# EAGLE design GoldFishFront-R2 (EAGLE 6.5.0)
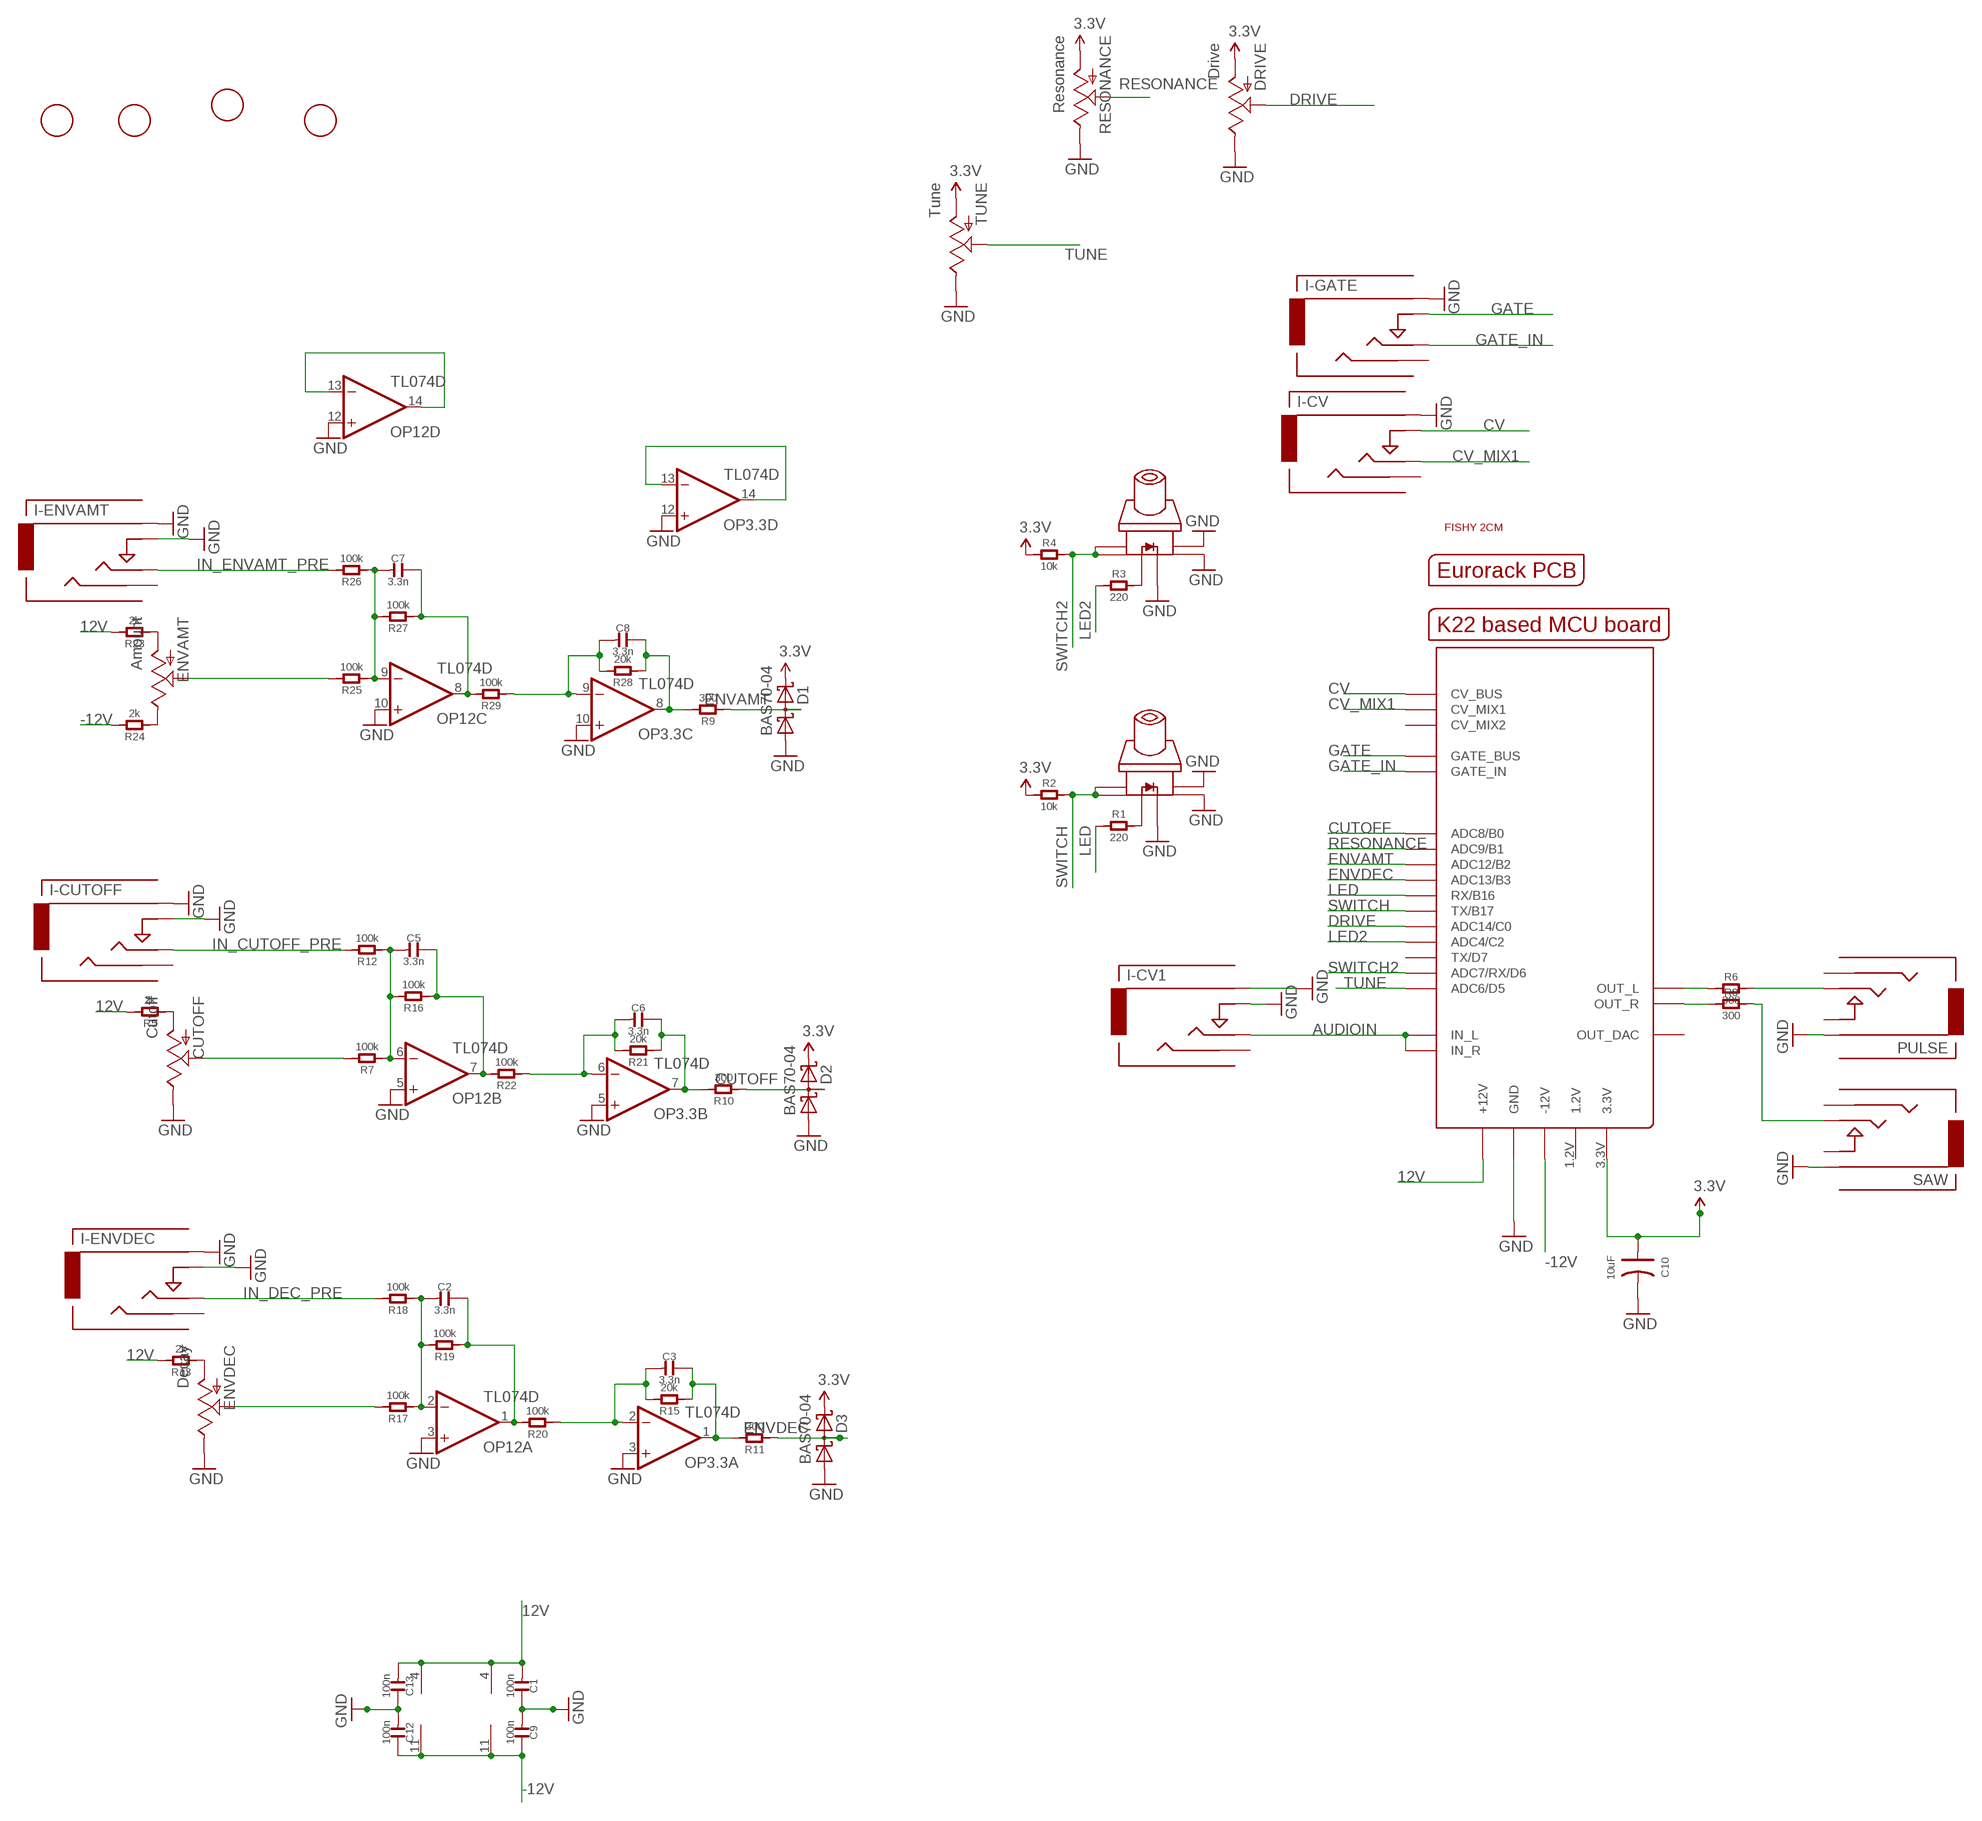
[diagram p0: schematic, sheet 1]

## Parts
C1  100n  C-0603  [C0603]
C2  3.3n  C-0603  [C0603]
C3  3.3n  C-0603  [C0603]
C5  3.3n  C-0603  [C0603]
C6  3.3n  C-0603  [C0603]
C7  3.3n  C-0603  [C0603]
C8  3.3n  C-0603  [C0603]
C9  100n  C-0603  [C0603]
C10  10uF  C-POLAR-A  [AVX-A]
C12  100n  C-0603  [C0603]
C13  100n  C-0603  [C0603]
CUTOFF  Cutoff  POTZEPHPOT  [OG-POTS_ALPS_POT_VERTICAL]
D1  BAS70-04  [SOT23]
D2  BAS70-04  [SOT23]
D3  BAS70-04  [SOT23]
DRIVE  Drive  POTZEPHPOT  [OG-POTS_ALPS_POT_VERTICAL]
ENVAMT  Amount  POTZEPHPOT  [OG-POTS_ALPS_POT_VERTICAL]
ENVDEC  Decay  POTZEPHPOT  [OG-POTS_ALPS_POT_VERTICAL]
I-CUTOFF  Cutoff  AUDIO-JACKINPUT  [3.5MM-JACK-SWITCH-13MM-INPUT]
I-CV  CV  AUDIO-JACKINPUT  [3.5MM-JACK-SWITCH-13MM-INPUT]
I-CV1  External  AUDIO-JACKINPUT  [3.5MM-JACK-SWITCH-13MM-INPUT]
I-ENVAMT  Amount  AUDIO-JACKINPUT  [3.5MM-JACK-SWITCH-13MM-INPUT]
I-ENVDEC  Decay  AUDIO-JACKINPUT  [3.5MM-JACK-SWITCH-13MM-INPUT]
I-GATE  Gate  AUDIO-JACKINPUT  [3.5MM-JACK-SWITCH-13MM-INPUT]
OP3.3  TL074D  [SO14]
OP12  TL074D  [SO14]
PULSE  Pulse  AUDIO-JACKOUTPUT  [3.5MM-JACK-SWITCH-13MM-OUTPUT]
R1  220  R-0603  [R0603]
R2  10k  R-0603  [R0603]
R3  220  R-0603  [R0603]
R4  10k  R-0603  [R0603]
R5  2k  R-0603  [R0603]
R6  300  R  [C0805]
R7  100k  R-0603  [R0603]
R8  300  R  [C0805]
R9  300  R-0603  [R0603]
R10  300  R-0603  [R0603]
R11  300  R-0603  [R0603]
R12  100k  R-0603  [R0603]
R13  2k  R-0603  [R0603]
R15  20k  R-0603  [R0603]
R16  100k  R-0603  [R0603]
R17  100k  R-0603  [R0603]
R18  100k  R-0603  [R0603]
R19  100k  R-0603  [R0603]
R20  100k  R-0603  [R0603]
R21  20k  R-0603  [R0603]
R22  100k  R-0603  [R0603]
R23  2k  R-0603  [R0603]
R24  2k  R-0603  [R0603]
R25  100k  R-0603  [R0603]
R26  100k  R-0603  [R0603]
R27  100k  R-0603  [R0603]
R28  20k  R-0603  [R0603]
R29  100k  R-0603  [R0603]
RESONANCE  Resonance  POTZEPHPOT  [OG-POTS_ALPS_POT_VERTICAL]
SAW  Saw  AUDIO-JACKOUTPUT  [3.5MM-JACK-SWITCH-13MM-OUTPUT]
TUNE  Tune  POTZEPHPOT  [OG-POTS_ALPS_POT_VERTICAL]
U$1  MCUBOARD  [MCUBASEBOARD]
U$2  EURORACK_PCB12HP  [EURORACK12HPPCB]
U$3  FISH2CM_SILK  [FISH_WITHSILK]
U$4  FIDUCIAL  [FIDUCIAL_1MM]
U$5  FIDUCIAL  [FIDUCIAL_1MM]
U$6  SWITCH_W_LED_PB6149L-X-102WHITE  [PB6149L]
U$7  FIDUCIAL  [FIDUCIAL_1MM]
U$8  FIDUCIAL  [FIDUCIAL_1MM]
U$17  SWITCH_W_LED_PB6149L-X-102WHITE  [PB6149L]

## Nets
3.3V: C10.+ D1.2(C2) D2.2(C2) D3.2(C2) DRIVE.P$3(A) R2.1 R4.1 RESONANCE.P$3(A) TUNE.P$3(A) U$1.3.3V
12V: C1.1 C13.1 OP3.3.4(P:V+) OP12.4(P:V+) R5.2 R13.2 R23.2 U$1.+12V@1(+12V) U$1.+12V@2(+12V)
-12V: C9.2 C12.2 OP3.3.11(P:V-) OP12.11(P:V-) R24.2 U$1.-12V@1(-12V) U$1.-12V@2(-12V)
AUDIOIN: I-CV1.TIP@1(TIP) I-CV1.TIP@2(TIP) U$1.IN_L U$1.IN_R
CUTOFF: D2.3(C1A2) R10.1 U$1.ADC8(ADC8/B0)
CV: I-CV.SWITCH@1(SWITCH) I-CV.SWITCH@2(SWITCH) U$1.CVBUS(CV_BUS)
CV_MIX1: I-CV.TIP@1(TIP) I-CV.TIP@2(TIP) U$1.CV_MIX1
DRIVE: DRIVE.P$2(S) U$1.ADC14(ADC14/C0)
ENVAMT: D1.3(C1A2) R9.1 U$1.ADC12(ADC12/B2)
ENVAMTPREPROTECTION: C8.2 OP3.3.8(C:OUT) R9.2 R28.1
ENVDEC: D3.3(C1A2) R11.1 U$1.ADC13(ADC13/B3)
ENVDECPREPROTECTION: C3.2 OP3.3.1(A:OUT) R11.2 R15.1
GATE: I-GATE.SWITCH@1(SWITCH) I-GATE.SWITCH@2(SWITCH) U$1.GATE_BUS
GATE_IN: I-GATE.TIP@1(TIP) I-GATE.TIP@2(TIP) U$1.GATE_IN
GND: C1.2 C9.1 C10.- C12.1 C13.2 CUTOFF.P$1(E) D1.1(A1) D2.1(A1) D3.1(A1) DRIVE.P$1(E) ENVDEC.P$1(E) I-CUTOFF.RING@1(RING) I-CUTOFF.RING@2(RING) I-CUTOFF.SWITCH@1(SWITCH) I-CUTOFF.SWITCH@2(SWITCH) I-CV1.RING@1(RING) I-CV1.RING@2(RING) I-CV1.SWITCH@1(SWITCH) I-CV1.SWITCH@2(SWITCH) I-CV.RING@1(RING) I-CV.RING@2(RING) I-ENVAMT.RING@1(RING) I-ENVAMT.RING@2(RING) I-ENVAMT.SWITCH@1(SWITCH) I-ENVAMT.SWITCH@2(SWITCH) I-ENVDEC.RING@1(RING) I-ENVDEC.RING@2(RING) I-ENVDEC.SWITCH@1(SWITCH) I-ENVDEC.SWITCH@2(SWITCH) I-GATE.RING@1(RING) I-GATE.RING@2(RING) OP3.3.3(A:+IN) OP3.3.5(B:+IN) OP3.3.10(C:+IN) OP3.3.12(D:+IN) OP12.3(A:+IN) OP12.5(B:+IN) OP12.10(C:+IN) OP12.12(D:+IN) PULSE.RING@1(RING) PULSE.RING@2(RING) RESONANCE.P$1(E) SAW.RING@1(RING) SAW.RING@2(RING) TUNE.P$1(E) U$1.GND@1(GND) U$1.GND@2(GND) U$1.GND@4(GND) U$1.GND@5(GND) U$1.GND@6(GND) U$1.GND@7(GND) U$1.GND@8(GND) U$1.GND@9(GND) U$1.GND_BUS(GND) U$6.3 U$6.4 U$6.LEDNEG(NEG) U$17.3 U$17.4 U$17.LEDNEG(NEG)
IN_CUTOFF_PRE: I-CUTOFF.TIP@1(TIP) I-CUTOFF.TIP@2(TIP) R12.2
IN_DEC_PRE: I-ENVDEC.TIP@1(TIP) I-ENVDEC.TIP@2(TIP) R18.2
IN_ENVAMT_PRE: I-ENVAMT.TIP@1(TIP) I-ENVAMT.TIP@2(TIP) R26.2
LED: R1.1 U$1.RX/B16
LED2: R3.1 U$1.ADC4(ADC4/C2)
N$1: PULSE.TIP@1(TIP) PULSE.TIP@2(TIP) R6.2
N$2: R8.2 SAW.TIP@1(TIP) SAW.TIP@2(TIP)
N$3: R6.1 U$1.OUT_L
N$4: R3.2 U$6.LEDPOS(POS)
N$5: CUTOFF.P$3(A) R5.1
N$6: R8.1 U$1.OUT_R
N$7: OP12.13(D:-IN) OP12.14(D:OUT)
N$8: OP3.3.13(D:-IN) OP3.3.14(D:OUT)
N$9: ENVDEC.P$3(A) R13.1
N$10: R1.2 U$17.LEDPOS(POS)
N$12: ENVDEC.P$2(S) R17.2
N$13: C2.1 OP12.2(A:-IN) R17.1 R18.1 R19.2
N$14: C2.2 OP12.1(A:OUT) R19.1 R20.2
N$15: C3.1 OP3.3.2(A:-IN) R15.2 R20.1
N$17: CUTOFF.P$2(S) R7.2
N$18: C5.1 OP12.6(B:-IN) R7.1 R12.1 R16.2
N$19: C5.2 OP12.7(B:OUT) R16.1 R22.2
N$20: C6.1 OP3.3.6(B:-IN) R21.2 R22.1
N$22: ENVAMT.P$3(A) R23.1
N$23: ENVAMT.P$1(E) R24.1
N$24: ENVAMT.P$2(S) R25.2
N$25: C7.1 OP12.9(C:-IN) R25.1 R26.1 R27.2
N$26: C7.2 OP12.8(C:OUT) R27.1 R29.2
N$27: C8.1 OP3.3.9(C:-IN) R28.2 R29.1
PREPROTECTCUTOFF: C6.2 OP3.3.7(B:OUT) R10.2 R21.1
RESONANCE: RESONANCE.P$2(S) U$1.ADC9(ADC9/B1)
SWITCH: R2.2 U$1.TX/B17 U$17.1 U$17.2
SWITCH2: R4.2 U$1.ADC7(ADC7/RX/D6) U$6.1 U$6.2
TUNE: TUNE.P$2(S) U$1.ADC6(ADC6/D5)
Unconnected: I-CUTOFF.SECOND@1(SECOND) I-CUTOFF.SECOND@2(SECOND) I-CV1.SECOND@1(SECOND) I-CV1.SECOND@2(SECOND) I-CV.SECOND@1(SECOND) I-CV.SECOND@2(SECOND) I-ENVAMT.SECOND@1(SECOND) I-ENVAMT.SECOND@2(SECOND) I-ENVDEC.SECOND@1(SECOND) I-ENVDEC.SECOND@2(SECOND) I-GATE.SECOND@1(SECOND) I-GATE.SECOND@2(SECOND) PULSE.SECOND@1(SECOND) PULSE.SECOND@2(SECOND) PULSE.SWITCH@1(SWITCH) PULSE.SWITCH@2(SWITCH) SAW.SECOND@1(SECOND) SAW.SECOND@2(SECOND) SAW.SWITCH@1(SWITCH) SAW.SWITCH@2(SWITCH) U$1.1.2V U$1.CV_MIX2 U$1.OUT_DAC U$1.TX/D7

## Library data of the parts
C1-C3 C5-C9 C12 C13 = OPL:C*
C10 = OPL:C-POLAR*
CUTOFF DRIVE ENVAMT ENVDEC RESONANCE TUNE = EurorackModularParts:POT
D1-D3 = diode:BAS70-04: Silicon Schottky Diodes General-purpose diode for high-speed switching
I-CUTOFF I-CV I-CV1 I-ENVAMT I-ENVDEC I-GATE PULSE SAW = EurorackModularParts:AUDIO-JACK: Switching Mono 3.5mm Audio Jack from Erthenvar.
OP3.3 OP12 = EurorackModularParts:TL074: OP AMP
R1-R13 R15-R29 = OPL:R*
U$1 = EurorackModularParts:MCUBOARD
U$2 = EurorackModularParts:EURORACK_PCB
U$3 = zephod-components:FISH2CM
U$4 U$5 U$7 U$8 = adafruit:FIDUCIAL: For use by pick and place machines to calibrate the vision/machine, 1mm By microbuilder.eu
U$6 U$17 = zephod-components:SWITCH_W_LED_PB6149L-X-102

## Net classes
0 default: width 0.254 mm
1 small: width 0.254 mm

## Board
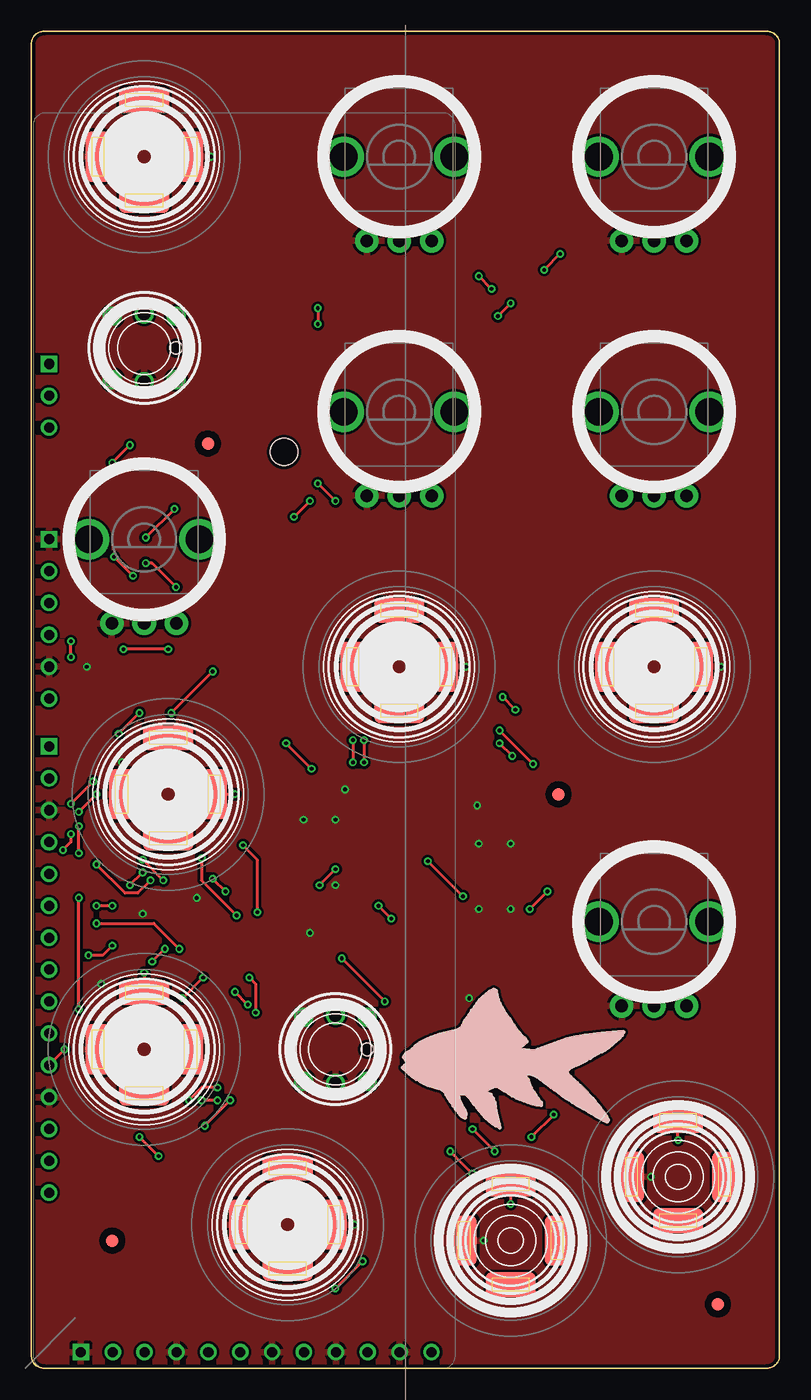
[diagram p1: board, top side]
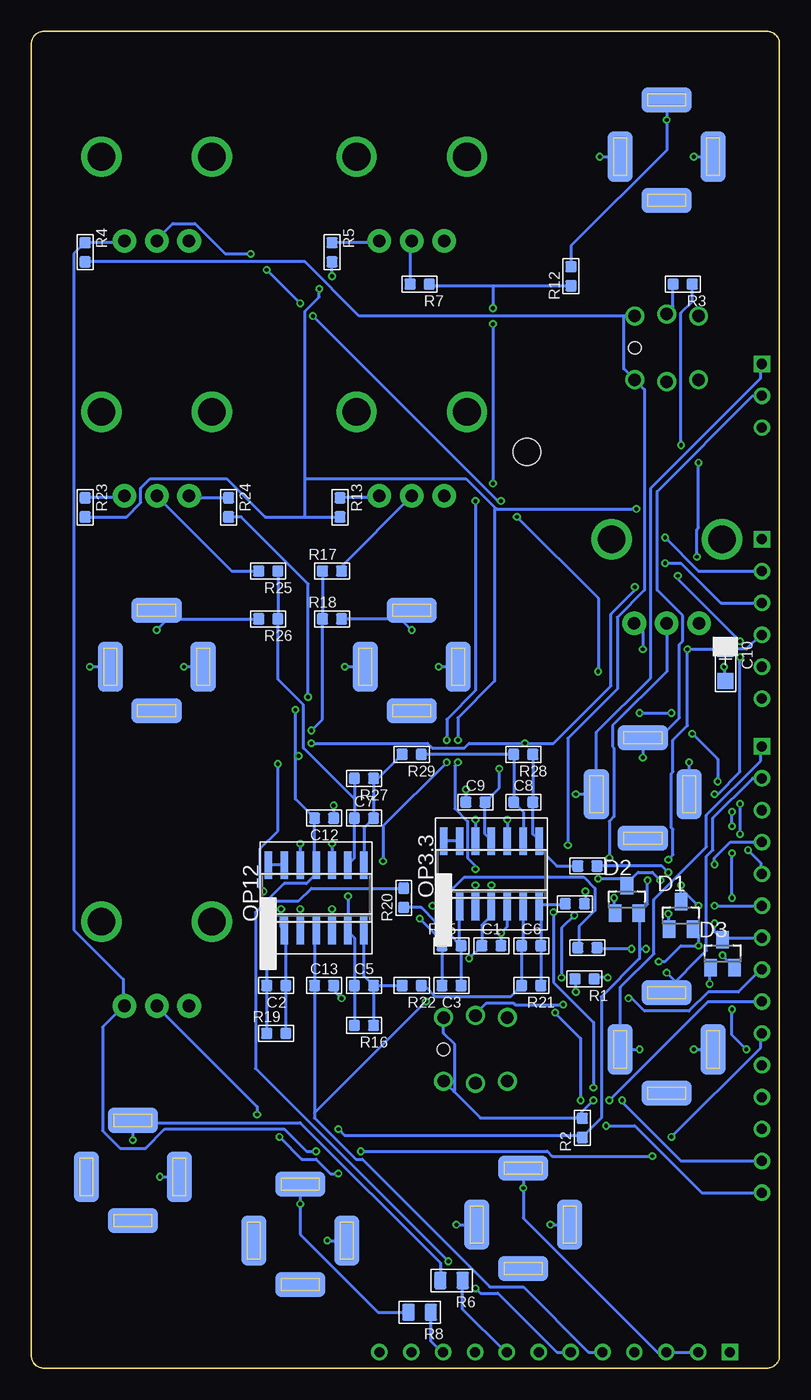
[diagram p2: board, bottom side, seen from below]

Size 59.62 x 106.5 mm. Coordinates in mm from the lower left corner, seen from the top.
Copper layers (1*16): Top 0.035mm / dielectric 1.5mm / Bottom 0.035mm
Design rules "default": minimum track width 6mil, minimum drill 12mil, track to track 8mil, track to pad 8mil, pad to pad 8mil, via to via 8mil, smd to smd 0mil, copper to edge 10mil, drill to drill 10mil, minimum pad ring 10mil, minimum via ring 6mil, stop-mask expansion 2mil, vias tented up to drill 100mil, thermal gap 10mil

### Footprints (pad centres in the part's own frame; a part is rotated, then mirrored left to right if it is on the bottom)
C0603 = smd 0.889 x 0.889: 1 -0.762,0; 2 0.762,0
AVX-A = smd 1.27 x 1.27: + -1.27,0; - 1.27,0
OG-POTS_ALPS_POT_VERTICAL = drill 1 pad 1.88: P$1 -2.58,-6.7; P$2 0,-6.7; P$3 2.58,-6.7 | drill 2.2 pad 3.175: P$4 4.4,0; P$5 -4.4,0
SOT23 = smd 1 x 1.4: 1 -0.95,-1.1; 2 0.95,-1.1; 3 0,1.1
3.5MM-JACK-SWITCH-13MM-INPUT = smd 2 x 4: RING@1 -3.7,0; SWITCH@1 3.7,0 | smd 2 x 4 bottom: RING@2 -3.7,0; SWITCH@2 3.7,0 | smd 4 x 2: SECOND@1 0,-3.5; TIP@1 0,4.5 | smd 4 x 2 bottom: SECOND@2 0,-3.5; TIP@2 0,4.5
SO14 = smd 0.6 x 2.2: 1 -3.81,-2.6; 2 -2.54,-2.6; 3 -1.27,-2.6; 4 0,-2.6; 5 1.27,-2.6; 6 2.54,-2.6; 7 3.81,-2.6; 8 3.81,2.6; 9 2.54,2.6; 10 1.27,2.6; 11 0,2.6; 12 -1.27,2.6; 13 -2.54,2.6; 14 -3.81,2.6
3.5MM-JACK-SWITCH-13MM-OUTPUT = smd 2 x 4: RING@1 -3.7,0; SWITCH@1 3.7,0 | smd 2 x 4 bottom: RING@2 -3.7,0; SWITCH@2 3.7,0 | smd 4 x 2: SECOND@1 0,-3.5; TIP@1 0,4.5 | smd 4 x 2 bottom: SECOND@2 0,-3.5; TIP@2 0,4.5
R0603 = smd 0.889 x 0.889: 1 -0.762,0; 2 0.762,0
C0805 = smd 1.016 x 1.397: 1 -0.889,0; 2 0.889,0
MCUBASEBOARD = drill 0.8: 1.2V 1.27,53.34; 3.3V 1.27,58.42; +12V@1 13.97,1.27; +12V@2 1.27,63.5; -12V@1 16.51,1.27; -12V@2 1.27,60.96; ADC4 1.27,24.13; ADC6 1.27,13.97; ADC7 1.27,16.51; ADC8 1.27,41.91; ADC9 1.27,39.37; ADC12 1.27,36.83; ADC13 1.27,34.29; ADC14 1.27,26.67; CV_MIX1 1.27,77.47; CV_MIX2 1.27,74.93; GATE_IN 1.27,46.99; GND@2 11.43,1.27; GND@4 24.13,1.27; GND@5 29.21,1.27; GND@6 1.27,55.88; GND@7 1.27,44.45; GND@8 1.27,21.59; GND@9 19.05,1.27; IN_L 6.35,1.27; IN_R 8.89,1.27; OUT_DAC 31.75,1.27; OUT_L 21.59,1.27; OUT_R 26.67,1.27; RX/B16 1.27,31.75; TX/B17 1.27,29.21; TX/D7 1.27,19.05 | drill 0.8 square: CVBUS 1.27,80.01; GATE_BUS 1.27,49.53; GND@1 3.81,1.27; GND_BUS 1.27,66.04 | hole 2.2: 20,73
FIDUCIAL_1MM = smd 1 x 1: 1 0,0
PB6149L = drill 1: 1 2.54,2.54; 2 2.54,-2.54; 3 -2.54,2.54; 4 -2.54,-2.54; LEDNEG 0,-2.7; LEDPOS 0,2.7 | hole 1: 2.54,0

### Placement (x,y rotation side)
C1  22.96,33.66 0 bottom
C2  40.1,30.48 180 bottom
C3  26.13,30.48 180 bottom
C5  33.12,30.48 0 bottom
C6  19.78,33.66 0 bottom
C7  33.12,43.81 0 bottom
C8  20.42,45.09 0 bottom
C9  24.23,45.09 0 bottom
C10  4.31,56 270 bottom
C12  36.3,43.81 180 bottom
C13  36.3,30.48 0 bottom
CUTOFF  29.31,96.52 0 top
D1  7.86,36.06 0 bottom
D2  12.16,37.33 0 bottom
D3  4.54,33.02 0 bottom
DRIVE  49.63,35.56 0 top
ENVAMT  49.63,76.2 0 top
ENVDEC  29.31,76.2 0 top
I-CUTOFF  8.99,96.52 0 top
I-CV  10.89,45.72 0 top
I-CV1  20.42,11.43 0 top
I-ENVAMT  49.63,55.88 0 top
I-ENVDEC  29.31,55.88 0 top
I-GATE  8.99,25.4 0 top
OP3.3  22.96,39.37 0 bottom
OP12  36.93,37.47 0 bottom
PULSE  51.53,15.24 0 top
R1  15.53,31.01 180 bottom
R2  15.72,19.14 90 bottom
R3  7.72,86.36 180 bottom
R4  55.34,88.9 270 bottom
R5  35.66,88.9 270 bottom
R6  26.13,6.99 180 bottom
R7  28.67,86.36 180 bottom
R8  28.67,4.45 180 bottom
R9  15.31,40 180 bottom
R10  16.31,37 180 bottom
R11  15.31,33.5 180 bottom
R12  16.61,87 90 bottom
R13  35.02,68.58 270 bottom
R15  26.13,33.66 0 bottom
R16  33.12,27.3 180 bottom
R17  35.66,63.5 0 bottom
R18  35.66,59.69 0 bottom
R19  40.1,26.67 0 bottom
R20  29.95,37.47 90 bottom
R21  19.78,30.48 180 bottom
R22  29.31,30.48 180 bottom
R23  55.34,68.58 270 bottom
R24  43.91,68.58 270 bottom
R25  40.74,63.5 180 bottom
R26  40.74,59.69 180 bottom
R27  33.12,46.99 180 bottom
R28  20.42,48.9 180 bottom
R29  29.31,48.9 180 bottom
RESONANCE  49.63,96.52 0 top
SAW  38.2,10.16 0 top
TUNE  8.99,66.04 0 top
U$1  0.13,0 0 top
U$2  -0.5,0 0 top
U$3  36.91,23.93 0 top
U$4  6.45,10.16 0 top
U$5  54.71,5.08 0 top
U$6  8.99,81.28 0 top
U$7  42.01,45.72 0 top
U$8  14.07,73.66 0 top
U$17  24.23,25.4 0 top

### Tracks (layer width: path | path; a pad name or v marks a point on that pad's centre or on a via)
3.3V  (via drill 0.3)
  Top 0.254: v10.89,57.28 v7.34,57.28 | v4.54,32.89 5.69,32.89 v6.45,33.66 | v10.64,33.4 v9.62,32.38 | v10.51,38.86 v8.86,40.51 | v36.93,17.27 v35.15,19.05
  Bottom 0.254: U$1.3.3V 1.5,58.42 2.64,57.28 4.29,57.28 C10.+ 4.42,57.28 v7.34,57.28 7.34,51.18 8.48,50.04 8.48,47.5 8.61,47.37 8.61,43.05 8.48,42.93 8.48,40.89 v8.86,40.51 | v10.89,57.28 10.89,58.67 11.53,59.31 TUNE.P$3 | v4.54,32.89 3.66,32 D3.2 | D1.2 6.83,34.92 6.45,34.54 v6.45,33.66 7.85,33.66 9.12,32.38 v9.62,32.38 | 11.15,33.4 11.15,36.2 D2.2 11.15,36.32 10.51,36.96 v10.51,38.86 | 11.15,33.4 11.15,32.64 14.2,29.59 14.2,19.94 15.72,18.41 R2.1 15.72,18.54 34.64,18.54 v35.15,19.05 | 11.15,33.4 v10.64,33.4 | RESONANCE.P$3 52.3,89.79 52.42,89.66 R4.1 56.23,88.77 56.23,34.92 52.3,30.99 52.3,28.96 DRIVE.P$3 52.3,28.83 53.95,27.18 53.95,18.92 52.55,17.53 50.52,17.53 48.99,19.05 39.47,19.05 37.69,17.27 v36.93,17.27
12V  (via drill 0.3)
  Top 0.254: v28.17,29.21 v24.74,32.64 | v36.68,85.98 v35.66,87 | v11.4,68.45 v9.12,66.17 | v24.23,39.75 v22.96,38.48 | v25.63,50.04 v25.63,48.26
  Bottom 0.254: OP12.4 36.93,34.8 37.06,34.67 C13.1 37.06,20.32 | U$1.+12V@1 15.21,1.27 20.42,6.48 23.09,6.48 33.25,16.64 33.75,16.64 37.06,19.94 37.06,20.32 | v24.74,32.64 C1.1 23.72,35.31 22.96,36.07 OP3.3.4 v22.96,38.48 | 37.06,20.32 v28.17,29.21 | 37.82,67.82 40.99,67.82 44.04,70.87 50.14,70.87 50.9,70.1 50.9,68.96 52.04,67.82 R23.2 | 37.82,67.82 R13.2 | v35.66,87 R5.2 | v36.68,85.98 36.68,85.34 37.82,84.2 37.82,70.87 | 37.82,67.82 37.82,70.87 | U$1.+12V@2 6.45,63.5 v9.12,66.17 | v11.4,68.45 22.58,68.45 22.64,68.52 | 22.64,68.52 24.99,70.87 37.82,70.87 | v24.23,39.75 24.23,40.01 24.86,40.64 24.86,43.56 25.88,44.58 25.88,48.01 v25.63,48.26 | v25.63,50.04 25.63,51.82 22.71,54.74 22.71,68.45 22.64,68.52
-12V  (via drill 0.3)
  Top 0.254: v9.12,64.14 9.62,64.14 v11.53,62.23 | v22.32,47.75 v20.29,49.78 | v38.58,52.45 v37.56,53.47 | v26.39,8.51 v24.23,6.35 | v38.33,48.77 v37.31,49.78
  Bottom 0.254: OP3.3.11 22.96,42.04 23.47,42.55 C9.2 22.32,46.23 v22.32,47.75 | U$1.-12V@2 4.67,60.96 7.85,64.14 v9.12,64.14 | v11.53,62.23 11.53,61.98 13.43,60.07 13.43,54.36 18.01,49.78 v20.29,49.78 24.74,49.78 25.12,49.4 27.66,49.4 28.04,49.78 v37.31,49.78 | R24.2 42.9,67.82 37.56,62.48 v37.56,53.47 | 38.58,48.77 38.58,45.34 C12.2 37.06,40.26 36.93,40.13 OP12.11 36.93,39.37 37.69,38.61 39.47,38.61 41.76,36.32 41.76,23.88 v26.39,8.51 | 38.58,48.77 v38.58,52.45 | U$1.-12V@1 17.75,1.27 22.45,5.97 23.85,5.97 v24.23,6.35 | 38.58,48.77 v38.33,48.77
AUDIOIN  (via drill 0.3)
  Top 0.254: v20.42,14.35 I-CV1.TIP@2
  Bottom 0.254: U$1.IN_L U$1.IN_R 9.75,1.27 20.42,11.94 v20.42,14.35 I-CV1.TIP@2
CUTOFF  (via drill 0.3)
  Top 0.254: v14.45,38.99 v15.47,37.97 | v5.18,40.13 7.47,37.85 8.48,37.85 v9.5,38.86
  Bottom 0.254: v15.47,37.97 15.47,37.08 R10.1 | v14.45,38.99 12.67,38.99 12.16,38.48 D2.3 12.16,38.61 11.28,39.5 10.13,39.5 v9.5,38.86 | U$1.ADC8 3.91,41.91 5.18,40.64 v5.18,40.13
CV  (via drill 0.3)
  Top 0.254: v16.23,45.72 I-CV.SWITCH@2
  Bottom 0.254: U$1.CVBUS 1.5,80.01 1.5,78.87 10.26,70.1 10.26,54.99 14.58,50.67 14.58,45.72 I-CV.SWITCH@2 v16.23,45.72
CV_MIX1  (via drill 0.3)
  Top 0.254: v10.89,48.64 I-CV.TIP@2
  Bottom 0.254: U$1.CV_MIX1 2.13,77.47 9.75,69.85 9.75,61.98 7.72,59.94 7.72,57.91 7.97,57.66 7.97,51.82 9.5,50.29 10.89,50.29 I-CV.TIP@2 v10.89,48.64
DRIVE  (via drill 0.3)
  Top 0.254: v10.13,16.89 v8.61,18.41 | v35.15,15.49 v33.37,17.27 | v41.63,20.19 v39.85,18.41
  Bottom 0.254: v8.61,18.41 1.5,25.53 1.5,26.67 U$1.ADC14 | v10.13,16.89 18.13,16.89 18.52,17.27 v33.37,17.27 | v35.15,15.49 35.79,15.49 36.93,16.64 38.07,16.64 v39.85,18.41 | v41.63,20.19 41.63,20.83 49.63,28.83 DRIVE.P$2
ENVAMT  (via drill 0.3)
  Top 0.254: v7.85,38.48 v8.86,39.5 | v6.45,36.83 v5.18,36.83
  Bottom 0.254: v8.86,39.5 9.37,40.01 14.45,40.01 R9.1 | 7.85,38.23 7.85,37.21 D1.3 | v5.18,36.83 U$1.ADC12 | 7.85,38.23 v6.45,36.83 | 7.85,38.23 v7.85,38.48
ENVAMTPREPROTECTION
  Bottom 0.254: R28.1 C8.2 19.66,42.55 19.15,42.04 OP3.3.8 19.15,41.4 17.75,40.01 16.1,40.01 R9.2
ENVDEC  (via drill 0.3)
  Top 0.254: v11.78,33.4 9.75,35.43 v5.18,35.43
  Bottom 0.254: v11.78,33.4 14.45,33.4 R11.1 | v5.18,35.43 5.18,34.8 4.54,34.16 D3.3 4.54,34.29 U$1.ADC13
ENVDECPREPROTECTION  (via drill 0.3)
  Top 0.254: v27.66,36.83 v28.67,35.81
  Bottom 0.254: C3.2 R15.1 26.9,34.04 v28.67,35.81 | 26.77,36.83 26.77,37.47 25.12,39.12 15.59,39.12 14.7,38.23 14.7,36.45 15.97,35.18 15.97,33.53 R11.2 | 26.77,36.83 v27.66,36.83 | 26.77,36.83 OP3.3.1
GATE  (via drill 0.3)
  Top 0.254: v11.15,25.4 I-GATE.SWITCH@2
  Bottom 0.254: 12.67,25.4 12.67,30.35 10.01,33.02 10.01,37.34 5.81,41.53 5.81,44.07 1.5,48.39 1.5,49.53 U$1.GATE_BUS | 12.67,25.4 v11.15,25.4 | 12.67,25.4 I-GATE.SWITCH@2
GATE_IN  (via drill 0.3)
  Top 0.254: v8.99,31.5 I-GATE.TIP@2
  Bottom 0.254: U$1.GATE_IN 2.13,46.99 5.31,43.81 5.31,41.27 5.81,40.77 5.81,33.27 8.99,30.1 I-GATE.TIP@2 8.36,30.86 v8.99,31.5
GND  (via drill 0.3)
  Bottom 0.254: C13.2 35.53,30.1 v34.9,29.46 | C1.2 v22.2,34.67 21.69,35.18 OP3.3.5 | v35.53,44.83 C12.1 | v24.99,46.1 C9.1 | v4.42,55.88 4.42,54.74 C10.- | v5.56,30.61 5.56,31.88 D3.1 | v8.86,36.2 8.86,35.05 D1.1 | v13.18,37.47 13.18,36.32 D2.1 | v24.23,38.48 OP3.3.3 | v21.69,43.69 OP3.3.10 | v24.23,43.69 OP3.3.12 | v35.66,36.58 OP12.5 | v38.2,36.58 OP12.3 | v35.66,41.78 OP12.10 | v38.2,41.78 OP12.12 | v18.26,11.43 I-CV1.RING@2 | v6.83,25.4 I-GATE.RING@2 | v25.75,11.43 I-CV1.SWITCH@1 | v36.04,10.16 SAW.RING@2 | v7.21,48.26 7.21,45.72 I-CV.RING@2 | v49.38,15.24 PULSE.RING@2 | v27.15,55.88 I-ENVDEC.RING@2 | v34.64,55.88 I-ENVDEC.SWITCH@2 | v47.47,55.88 I-ENVAMT.RING@2 | v6.83,96.52 I-CUTOFF.RING@2 | v54.96,55.88 I-ENVAMT.SWITCH@2 | v14.32,96.52 I-CUTOFF.SWITCH@2
  pour Top: -1.17,106.68 59.79,106.68 59.79,0 -1.17,0
IN_CUTOFF_PRE  (via drill 0.3)
  Top 0.254: v8.99,99.44 I-CUTOFF.TIP@2
  Bottom 0.254: R12.2 16.61,89.41 8.99,97.03 v8.99,99.44 I-CUTOFF.TIP@2
IN_DEC_PRE  (via drill 0.3)
  Top 0.254: v29.31,58.8 I-ENVDEC.TIP@2
  Bottom 0.254: 30.2,59.69 29.95,59.69 29.31,60.33 I-ENVDEC.TIP@2 30.2,59.69 | 30.2,59.69 R18.2 | 30.2,59.69 v29.31,58.8
IN_ENVAMT_PRE  (via drill 0.3)
  Top 0.254: v49.63,58.8 I-ENVAMT.TIP@2
  Bottom 0.254: 48.74,59.69 48.99,59.69 49.63,60.33 I-ENVAMT.TIP@2 48.74,59.69 | 48.74,59.69 R26.2 | 48.74,59.69 v49.63,58.8
LED  (via drill 0.3)
  Top 0.254: v12.04,29.46 v13.69,31.11
  Bottom 0.254: v13.69,31.11 14.7,31.11 R1.1 | v12.04,29.46 11.78,29.46 10.77,28.45 7.21,28.45 5.69,29.97 3.27,29.97 1.5,31.75 U$1.RX/B16
LED2  (via drill 0.3)
  Top 0.254: v6.45,72.14 v7.85,73.53 | v8.1,63.12 v6.58,64.64 | v3.15,56.64 v3.15,57.91 | v3.78,44.32 v5.18,45.72 | v3.78,41.02 v3.78,43.18 | v3.78,28.57 v3.78,37.47 | v2.64,25.4 1.37,24.13 U$1.ADC4
  Bottom 0.254: R3.1 6.96,84.96 7.85,84.07 v7.85,73.53 | v6.45,72.14 6.45,66.93 6.58,66.8 v6.58,64.64 | v8.1,63.12 8.1,62.87 v3.15,57.91 | v3.15,56.64 3.15,47.5 4.93,45.72 v5.18,45.72 | v3.78,43.18 v3.78,44.32 | v3.78,37.47 v3.78,41.02 | v3.78,28.57 3.78,26.54 v2.64,25.4
N$1  (via drill 0.3)
  Top 0.254: v51.53,18.16 PULSE.TIP@2
  Bottom 0.254: R6.2 27.02,8.38 38.2,19.56 51.41,19.56 51.53,19.68 PULSE.TIP@2 v51.53,18.16
N$2  (via drill 0.3)
  Top 0.254: v38.2,13.08 SAW.TIP@2
  Bottom 0.254: R8.2 31.98,4.45 38.2,10.67 v38.2,13.08 SAW.TIP@2
N$3
  Bottom 0.254: R6.1 25.25,4.7 21.82,1.27 U$1.OUT_L
N$4
  Bottom 0.254: R3.2 8.48,84.58 8.99,84.07 U$6.LEDPOS
N$5
  Bottom 0.254: R5.1 32.1,89.66 31.98,89.79 CUTOFF.P$3
N$6
  Bottom 0.254: R8.1 27.79,2.16 26.9,1.27 U$1.OUT_R
N$7
  Bottom 0.254: OP12.13 39.47,40.13 40.74,40.13 OP12.14
N$8
  Bottom 0.254: OP3.3.13 25.5,42.04 26.77,42.04 OP3.3.14
N$9
  Bottom 0.254: R13.1 32.1,69.34 31.98,69.47 ENVDEC.P$3
N$10  (via drill 0.3)
  Top 0.254: v17.24,28.96 v16.23,29.97
  Bottom 0.254: v16.23,29.97 16.23,30.99 R1.2 | v17.24,28.96 21.05,28.96 21.18,29.08 23.34,29.08 24.23,28.19 U$17.LEDPOS
N$12
  Bottom 0.254: R17.2 34.9,63.88 29.31,69.47 ENVDEC.P$2
N$13  (via drill 0.3)
  Top 0.254: v39.98,48.13 v37.31,50.8 | v39.72,36.58 v41.12,37.97
  Bottom 0.254: R17.1 R18.1 36.42,51.69 v37.31,50.8 | R19.2 C2.1 39.34,34.67 39.47,34.8 OP12.2 39.47,34.92 39.72,35.18 v39.72,36.58 | v39.98,48.13 39.98,42.8 41.38,41.4 41.38,38.23 v41.12,37.97
N$14
  Bottom 0.254: R19.1 C2.2 40.87,34.67 40.74,34.8 OP12.1 40.74,36.58 40.1,37.21 38.33,37.21 37.31,38.23 R20.2
N$15
  Bottom 0.254: R15.2 C3.1 | R20.1 28.55,36.7 27.4,35.56 27.4,35.43 26.52,34.54 26.26,34.54 R15.2 | OP3.3.2 25.5,33.91 R15.2
N$17
  Bottom 0.254: R7.2 29.44,89.66 29.31,89.79 CUTOFF.P$2
N$18  (via drill 0.3)
  Top 0.254: v31.6,40.39 v34.39,37.59 | v26.52,50.04 v26.52,48.26 | v22.83,70.48 v24.23,69.09 | v22.83,84.45 v22.83,83.19
  Bottom 0.254: R16.2 C5.1 33.88,34.29 34.39,34.8 OP12.6 v34.39,37.59 | 22.83,86.23 27.79,86.23 R7.1 | 22.83,86.23 R12.1 | v31.6,40.39 31.6,43.18 v26.52,48.26 | v26.52,50.04 26.52,51.69 24.23,53.98 v24.23,69.09 | v22.83,83.19 v22.83,70.48 | 22.83,86.23 v22.83,84.45
N$19
  Bottom 0.254: C5.2 R16.1 | C5.2 R22.2 | OP12.7 33.12,31.24 C5.2
N$20
  Bottom 0.254: R22.1 28.29,30.48 27.4,29.59 21.44,29.59 R21.2 C6.1 20.42,33.78 OP3.3.6
N$22
  Bottom 0.254: R23.1 52.42,69.34 52.3,69.47 ENVAMT.P$3
N$23
  Bottom 0.254: R24.1 46.84,69.34 46.96,69.47 ENVAMT.P$1
N$24
  Bottom 0.254: R25.2 43.66,63.5 49.63,69.47 ENVAMT.P$2
N$25
  Bottom 0.254: R25.1 R26.1 39.98,54.86 37.95,52.83 37.95,49.4 33.88,45.34 | R27.2 33.88,45.34 | 33.88,45.34 C7.1 33.88,40.64 34.39,40.13 OP12.9
N$26
  Bottom 0.254: 32.36,46.61 C7.2 33.12,43.05 OP12.8 | 32.36,46.61 R29.2 | 32.36,46.61 R27.1
N$27
  Bottom 0.254: R29.1 R28.2 C8.1 20.42,44.32 OP3.3.9
PREPROTECTCUTOFF
  Bottom 0.254: R21.1 C6.2 19.02,36.83 OP3.3.7 19.15,36.83 19.02,36.96 17.12,36.96 R10.2
RESONANCE  (via drill 0.3)
  Top 0.254: v2.51,41.27 3.15,41.91 v3.15,42.55 | v4.93,46.74 v3.15,44.96 | v8.61,52.2 v6.96,50.55 | v14.45,55.5 v11.15,52.2 | v22.2,69.09 v20.93,67.82 | v38.2,84.84 v37.18,83.82 | v42.14,88.77 v40.87,87.5
  Bottom 0.254: v2.51,41.27 1.5,40.26 1.5,39.37 U$1.ADC9 | v3.15,44.96 v3.15,42.55 | v4.93,46.74 4.93,48.51 v6.96,50.55 | v11.15,52.2 v8.61,52.2 | v14.45,55.5 14.45,61.34 v20.93,67.82 | v22.2,69.09 22.45,69.09 v37.18,83.82 | v40.87,87.5 v38.2,84.84 | v42.14,88.77 44.17,88.77 46.58,91.19 48.36,91.19 49.63,89.92 RESONANCE.P$2
SWITCH  (via drill 0.3)
  Top 0.254: v14.83,21.34 v13.56,21.34
  Bottom 0.254: 16.23,19.94 23.85,19.94 25.95,22.04 | 16.23,19.94 15.72,19.94 R2.2 | U$17.2 25.95,22.04 | U$1.TX/B17 5.69,29.21 v13.56,21.34 | 16.23,19.94 v14.83,21.34 | U$17.1 26.77,26.67 25.88,25.78 25.88,22.1 25.95,22.04
SWITCH2  (via drill 0.3)
  Top 0.254: v12.55,21.34 13.56,22.35 v14.83,22.35 | v18.01,36.32 18.01,40.51 v16.86,41.66
  Bottom 0.254: R4.2 37.82,88.14 33.5,83.82 12.42,83.82 | U$6.1 12.42,83.82 | U$1.ADC7 7.85,16.51 12.55,21.21 v12.55,21.34 | v14.83,22.35 14.83,27.56 18.01,30.73 v18.01,36.32 | v16.86,41.66 16.86,50.16 12.93,54.1 12.93,59.82 10.77,61.98 10.77,77.98 U$6.2 12.42,79.63 12.42,83.82
TUNE  (via drill 0.3)
  Top 0.254: v15.85,21.34 v13.82,19.3 | v17.88,28.32 17.88,30.61 v17.37,31.11 | v16.36,36.07 13.56,38.86 v13.56,40.64
  Bottom 0.254: U$1.ADC6 6.2,13.97 11.53,19.3 v13.82,19.3 | v15.85,21.34 15.85,26.29 v17.88,28.32 | v17.37,31.11 17.37,35.05 v16.36,36.07 | v13.56,40.64 13.56,43.56 13.18,43.94 13.18,49.4 13.31,49.53 13.31,51.18 8.99,55.5 TUNE.P$2